# Altium schematic sheet Sheet1.SchDoc
size A4
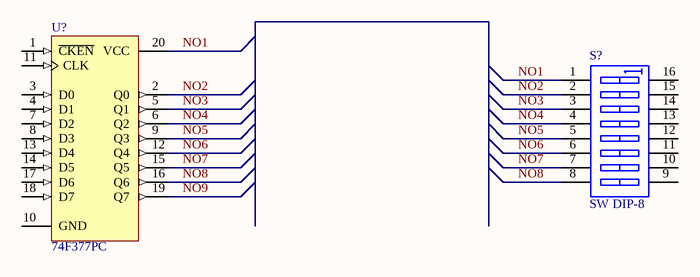
[diagram p0: Sheet1.SchDoc]

## Parts
S?  SW DIP-8  [DIP_SW_8WAY_SMD]
U?  74F377PC  [N20A]

## Nets
NO1: S?.1(A1) U?.20(VCC)
NO2: S?.2(A2) U?.2(Q0)
NO3: S?.3(A3) U?.5(Q1)
NO4: S?.4(A4) U?.6(Q2)
NO5: S?.5(A5) U?.9(Q3)
NO6: S?.6(A6) U?.12(Q4)
NO7: S?.7(A7) U?.15(Q5)
NO8: S?.8(A8) U?.16(Q6)
NO9: U?.19(Q7)

Not connected (* = marked no-connect by the designer): S? 9(B8) 10(B7) 11(B6) 12(B5) 13(B4) 14(B3) 15(B2) 16(B1); U? 1(~{CKEN}) 3(D0) 4(D1) 7(D2) 8(D3) 10(GND) 11(CLK) 13(D4) 14(D5) 17(D6) 18(D7)

## Library data of the parts
S? = SW DIP-8: DIP Switch; Published: 24-Mar-1999; LatestRevisionDate: 17-Jul-2002; LatestRevisionNote: Re-released for DXP Platform.; Publisher: Altium Limited
U? = 74F377PC: Octal D-Type Flip-Flop with Clock Enable; PackageDocument: 2000; Published: 15-Apr-2002; DatasheetDocument: May-1995; PackageReference: N20A; Publisher: Altium Limited; Code_JEDEC: MS-001-AD